# EAGLE design in2-top (EAGLE 6.4)
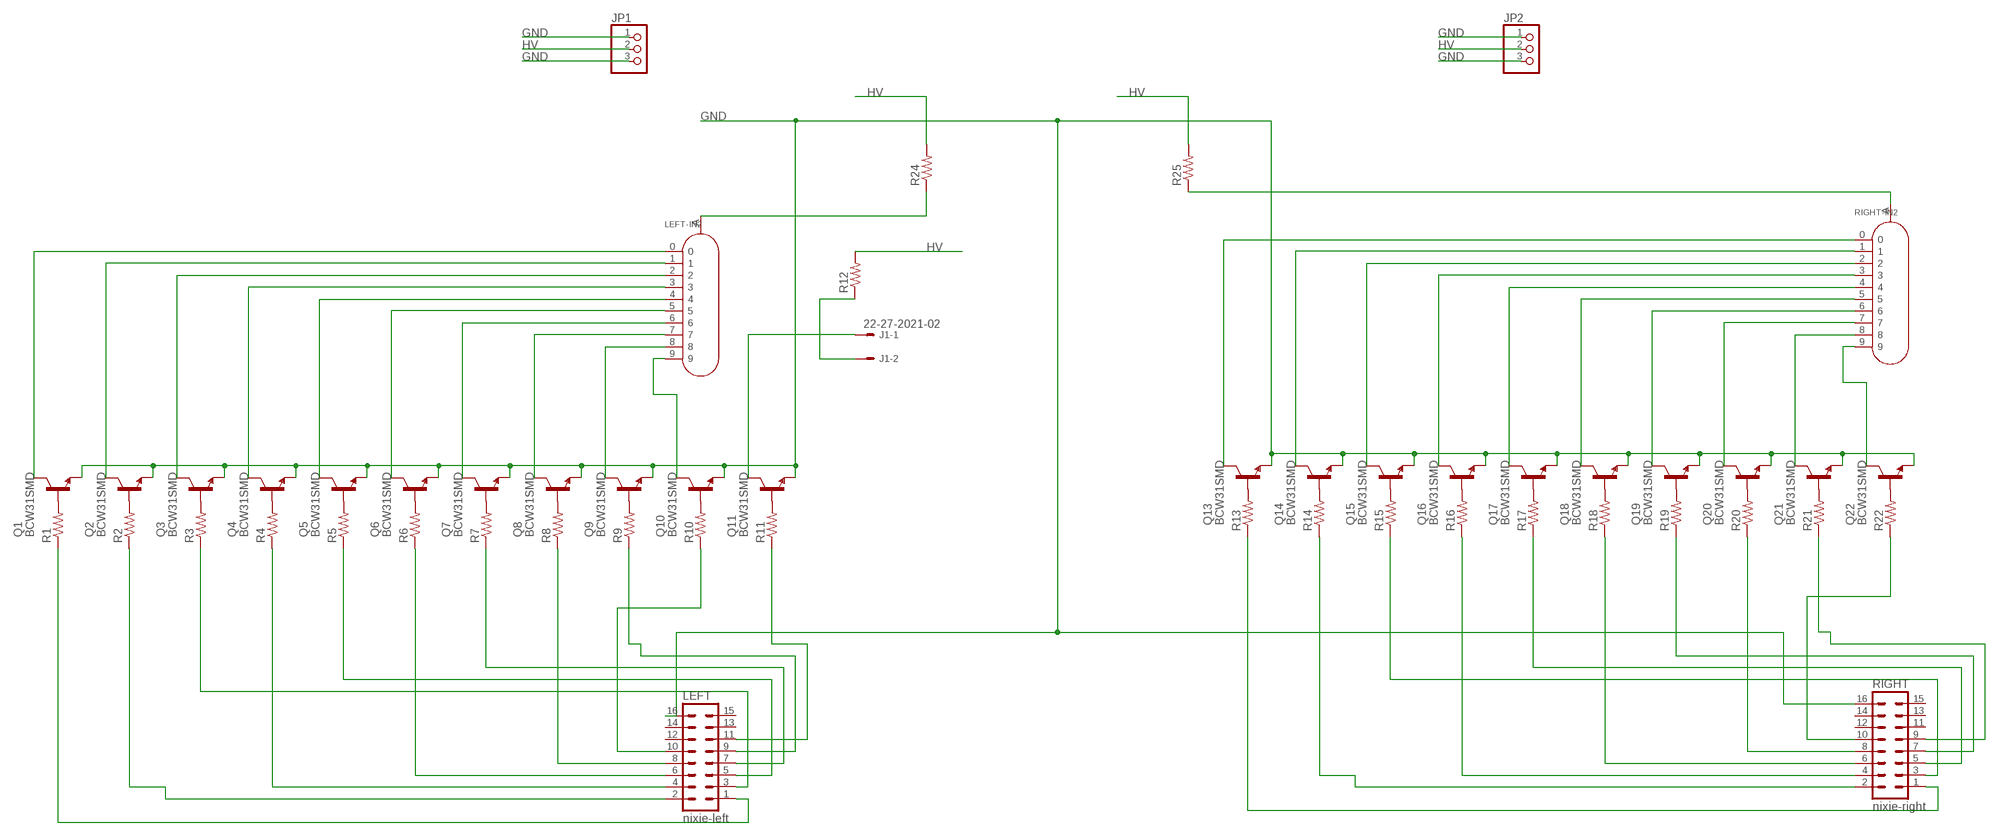
[diagram p0: schematic, sheet 1]

## Parts
J1  22-27-2021-02  [6410-02]
JP1  PINHD-1X3  [1X03]
JP2  PINHD-1X3  [1X03]
LEFT  nixie-left  ML16  [ML16]
LEFT-IN2  IN-2  [IN-2]
Q1  BCW31SMD  [SOT23-BEC]
Q2  BCW31SMD  [SOT23-BEC]
Q3  BCW31SMD  [SOT23-BEC]
Q4  BCW31SMD  [SOT23-BEC]
Q5  BCW31SMD  [SOT23-BEC]
Q6  BCW31SMD  [SOT23-BEC]
Q7  BCW31SMD  [SOT23-BEC]
Q8  BCW31SMD  [SOT23-BEC]
Q9  BCW31SMD  [SOT23-BEC]
Q10  BCW31SMD  [SOT23-BEC]
Q11  BCW31SMD  [SOT23-BEC]
Q13  BCW31SMD  [SOT23-BEC]
Q14  BCW31SMD  [SOT23-BEC]
Q15  BCW31SMD  [SOT23-BEC]
Q16  BCW31SMD  [SOT23-BEC]
Q17  BCW31SMD  [SOT23-BEC]
Q18  BCW31SMD  [SOT23-BEC]
Q19  BCW31SMD  [SOT23-BEC]
Q20  BCW31SMD  [SOT23-BEC]
Q21  BCW31SMD  [SOT23-BEC]
Q22  BCW31SMD  [SOT23-BEC]
R1  R-US_M0805  [M0805]
R2  R-US_M0805  [M0805]
R3  R-US_M0805  [M0805]
R4  R-US_M0805  [M0805]
R5  R-US_M0805  [M0805]
R6  R-US_M0805  [M0805]
R7  R-US_M0805  [M0805]
R8  R-US_M0805  [M0805]
R9  R-US_M0805  [M0805]
R10  R-US_M0805  [M0805]
R11  R-US_M0805  [M0805]
R12  R-US_R0805  [R0805]
R13  R-US_M0805  [M0805]
R14  R-US_M0805  [M0805]
R15  R-US_M0805  [M0805]
R16  R-US_M0805  [M0805]
R17  R-US_M0805  [M0805]
R18  R-US_M0805  [M0805]
R19  R-US_M0805  [M0805]
R20  R-US_M0805  [M0805]
R21  R-US_M0805  [M0805]
R22  R-US_M0805  [M0805]
R24  R-US_R0805  [R0805]
R25  R-US_R0805  [R0805]
RIGHT  nixie-right  ML16  [ML16]
RIGHT-IN2  IN-2  [IN-2]

## Nets
GND: JP1.1 JP1.3 JP2.1 JP2.3 LEFT.16 Q1.E Q2.E Q3.E Q4.E Q5.E Q6.E Q7.E Q8.E Q9.E Q10.E Q11.E Q13.E Q14.E Q15.E Q16.E Q17.E Q18.E Q19.E Q20.E Q21.E Q22.E RIGHT.16
HV: JP1.2 JP2.2 R12.2 R24.2 R25.2
N$1: LEFT-IN2.0 Q1.C
N$2: LEFT-IN2.1 Q2.C
N$3: Q1.B R1.2
N$4: Q2.B R2.2
N$5: Q3.B R3.2
N$6: Q4.B R4.2
N$7: Q5.B R5.2
N$8: Q6.B R6.2
N$9: Q7.B R7.2
N$10: Q8.B R8.2
N$11: Q9.B R9.2
N$12: Q10.B R10.2
N$13: Q11.B R11.2
N$14: LEFT-IN2.A R24.1
N$15: LEFT-IN2.2 Q3.C
N$16: LEFT-IN2.3 Q4.C
N$17: LEFT-IN2.4 Q5.C
N$18: LEFT-IN2.5 Q6.C
N$19: LEFT-IN2.6 Q7.C
N$20: LEFT-IN2.7 Q8.C
N$21: LEFT-IN2.8 Q9.C
N$22: LEFT-IN2.9 Q10.C
N$25: Q13.B R13.2
N$26: Q14.B R14.2
N$27: LEFT.1 R1.1
N$28: LEFT.2 R2.1
N$29: LEFT.3 R3.1
N$30: LEFT.4 R4.1
N$31: LEFT.5 R5.1
N$32: LEFT.6 R6.1
N$33: LEFT.7 R7.1
N$34: LEFT.8 R8.1
N$35: LEFT.9 R9.1
N$36: LEFT.10 R10.1
N$37: LEFT.11 R11.1
N$38: R25.1 RIGHT-IN2.A
N$39: Q15.B R15.2
N$40: Q16.B R16.2
N$41: Q17.B R17.2
N$42: Q18.B R18.2
N$43: Q19.B R19.2
N$44: Q20.B R20.2
N$45: Q21.B R21.2
N$46: Q22.B R22.2
N$48: R13.1 RIGHT.1
N$49: R14.1 RIGHT.2
N$50: R15.1 RIGHT.3
N$51: R16.1 RIGHT.4
N$52: R17.1 RIGHT.5
N$53: R18.1 RIGHT.6
N$54: R19.1 RIGHT.7
N$55: R20.1 RIGHT.8
N$56: R21.1 RIGHT.9
N$57: R22.1 RIGHT.10
N$59: J1.2 R12.1
N$60: Q13.C RIGHT-IN2.0
N$61: Q14.C RIGHT-IN2.1
N$62: Q15.C RIGHT-IN2.2
N$63: Q16.C RIGHT-IN2.3
N$64: Q17.C RIGHT-IN2.4
N$65: Q18.C RIGHT-IN2.5
N$66: Q19.C RIGHT-IN2.6
N$67: Q20.C RIGHT-IN2.7
N$68: Q21.C RIGHT-IN2.8
N$69: Q22.C RIGHT-IN2.9
N$72: J1.1 Q11.C
Unconnected: LEFT.12 LEFT.13 LEFT.14 LEFT.15 RIGHT.11 RIGHT.12 RIGHT.13 RIGHT.14 RIGHT.15

## Library data of the parts
J1 = con-molex:22-?-02: CONNECTOR wire to board 2.54 mm (.1 inch) pitch header; OC_FARNELL: unknown; OC_NEWARK: unknown
JP1 JP2 = pinhead:PINHD-1X3: PIN HEADER
LEFT RIGHT = con-ml:ML16: HARTING; OC_FARNELL: unknown; OC_NEWARK: unknown
LEFT-IN2 RIGHT-IN2 = 0-nixies-russian:IN-2: IN-2 Miniature Nixie Tube 19mm Dia, Top View Strike voltage: <200V Standby voltage: <100V Current: 1.5mA
Q1-Q11 Q13-Q22 = transistor-npn:BCW31*: NPN Transistor
R1-R22 R24 R25 = resistor:R-US_: RESISTOR, American symbol

## Board
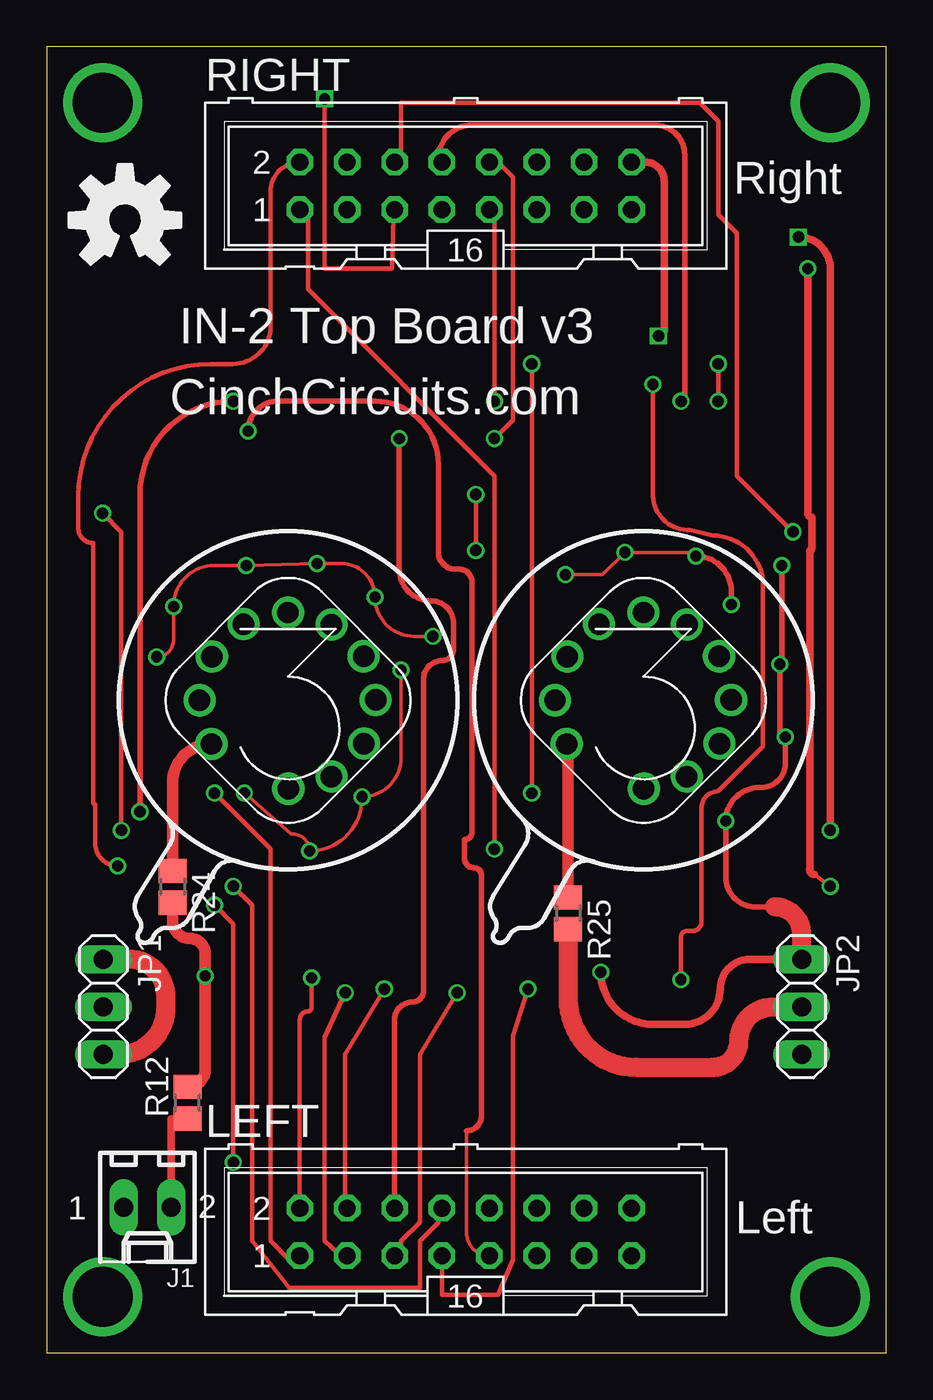
[diagram p1: board, top side]
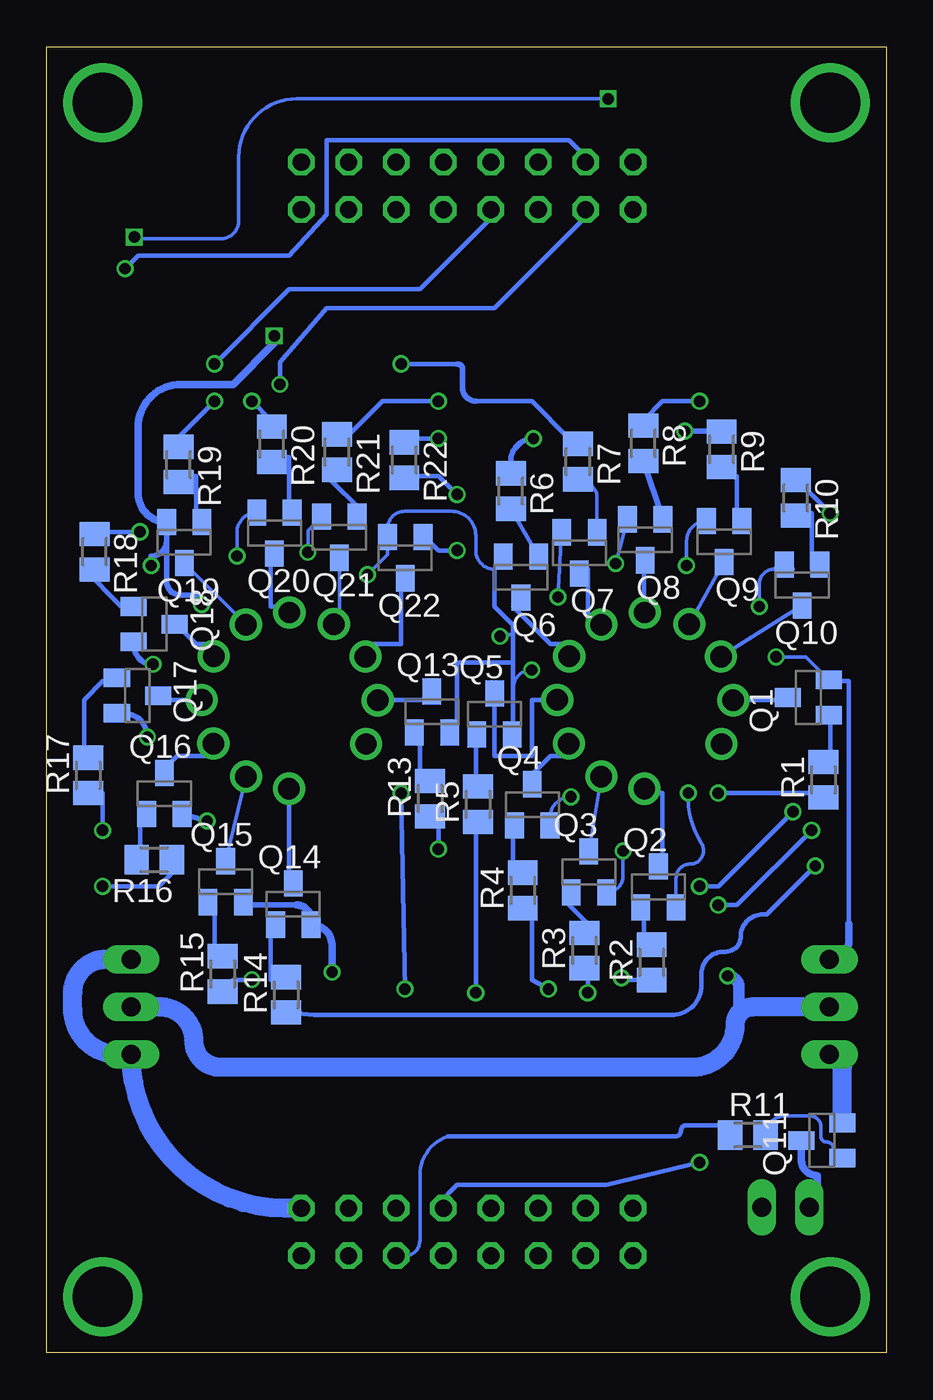
[diagram p2: board, bottom side, seen from below]

Size 45 x 70 mm. Coordinates in mm from the lower left corner, seen from the top.
Outline: 0,0 45,0 45,70 0,70 0,0
Copper layers (1*16): Top 0.035mm / dielectric 1.5mm / Bottom 0.035mm
Design rules "Fusion_eagle_rule_v1.1": minimum track width 6mil, minimum drill 12mil, track to track 6mil, track to pad 6mil, pad to pad 6mil, via to via 6mil, smd to smd 0mil, copper to edge 10mil, drill to drill 10mil, minimum pad ring 10mil, minimum via ring 6mil, stop-mask expansion 2mil, vias tented up to drill 100mil, thermal gap 10mil

### Footprints (pad centres in the part's own frame; a part is rotated, then mirrored left to right if it is on the bottom)
6410-02 = drill 1.016 long: 1 1.27,0; 2 -1.27,0
1X03 = drill 1.016 long: 1 -2.54,0; 2 0,0; 3 2.54,0
ML16 = drill 0.914 octagon: 1 -8.89,-1.27; 2 -8.89,1.27; 3 -6.35,-1.27; 4 -6.35,1.27; 5 -3.81,-1.27; 6 -3.81,1.27; 7 -1.27,-1.27; 8 -1.27,1.27; 9 1.27,-1.27; 10 1.27,1.27; 11 3.81,-1.27; 12 3.81,1.27; 13 6.35,-1.27; 14 6.35,1.27; 15 8.89,-1.27; 16 8.89,1.27
IN-2 = drill 1.15: 0 -4.745,0; 1 0.02,-4.735; 2 2.326,-4.089; 3 4.07,-2.32; 4 4.695,0.02; 5 4.052,2.363; 6 2.33,4.057; 7 0,4.705; 8 -2.388,4.081; 9 -4.082,2.343; A -4.11,-2.34
SOT23-BEC = smd 1 x 1.4: B -0.95,-1.1; C 0,1.1; E 0.95,-1.1
M0805 = smd 1.3 x 1.6: 1 -0.95,0; 2 0.95,0
R0805 = smd 1.3 x 1.5: 1 -0.85,0; 2 0.85,0

### Placement (x,y rotation side)
J1  5.4,7.8 180 top
JP1  3.04,18.54 270 top
JP2  40.47,18.54 270 top
LEFT  22.46,6.48 0 top
LEFT-IN2  12.94,34.97 0 top
Q1  4.17,35.12 90 bottom
Q2  12.21,24.97 0 bottom
Q3  15.94,25.77 0 bottom
Q4  18.97,29.37 0 bottom
Q5  20.99,34.23 0 bottom
Q6  19.58,41.57 180 bottom
Q7  16.45,42.87 180 bottom
Q8  12.92,43.57 180 bottom
Q9  8.69,43.47 180 bottom
Q10  4.51,41.15 180 bottom
Q11  3.45,11.38 90 bottom
Q13  24.35,34.35 0 bottom
Q14  31.78,24.05 0 bottom
Q15  35.41,25.25 0 bottom
Q16  38.69,29.97 0 bottom
Q17  40.13,35.22 270 bottom
Q18  39.23,39.05 270 bottom
Q19  37.62,43.43 180 bottom
Q20  32.79,43.93 180 bottom
Q21  29.31,43.71 180 bottom
Q22  25.78,42.61 180 bottom
R1  3.37,30.71 90 bottom
R2  12.57,20.93 90 bottom
R3  16.18,21.56 90 bottom
R4  19.48,24.78 90 bottom
R5  21.88,29.4 90 bottom
R6  20.12,46.18 270 bottom
R7  16.52,47.76 270 bottom
R8  13.02,48.74 270 bottom
R9  8.82,48.42 270 bottom
R10  4.85,45.82 270 bottom
R11  7.41,11.67 0 bottom
R12  7.55,13.4 90 top
R13  24.45,29.7 90 bottom
R14  32.17,19.19 90 bottom
R15  35.57,20.31 90 bottom
R16  39.23,26.43 180 bottom
R17  42.77,30.95 90 bottom
R18  42.43,42.93 270 bottom
R19  37.93,47.61 270 bottom
R20  32.93,48.69 270 bottom
R21  29.43,48.27 270 bottom
R22  25.83,47.85 270 bottom
R24  6.75,24.98 270 top
R25  27.95,23.56 270 top
RIGHT  22.46,62.54 0 top
RIGHT-IN2  31.99,34.97 0 top

### Tracks (layer width: path | path; a pad name or v marks a point on that pad's centre or on a via)
GND  (via drill 0.6)
  Top 0.2: v5.9,37.3 arc90 6.8,38.2 v6.8,40 arc-90 9,42.2 v10.7,42.2 v14.5,42.3 15.8,42.3 arc-90 v17.6,40.5 arc90 19.7,38.4 v20.7,38.4 | v10.6,30 13.1,27.8 13.2,27.8 arc-90 v14.1,26.9 arc90 16.9,29.7 v16.9,29.8 arc90 19,31.9 v19,36.6 | v27.8,41.7 29.8,41.7 v31,42.9 34.6,42.9 arc-90 v34.8,42.7
  Top 0.305: 39.02,23.9 38,23.9 arc-90 36.4,25.5 v36.4,28.5 arc-90 38.2,30.3 38.3,30.3 arc90 39.6,31.6 v39.6,33 arc-90 39.3,33.3 v39.3,36.9 arc90 39.4,37 v39.4,42.2 | v36.7,40.1 36.7,40.8 arc90 v34.8,42.7
  Top 0.406: RIGHT.16 32.09,63.81 arc-90 33.1,62.8 33.1,54.8 arc-90 v32.8,54.5 | v29.7,20.4 arc90 32.5,17.6 34.2,17.6 arc90 36.1,19.5 arc-90 37.68,21.08 JP2.1
  Top 1.016: JP2.1 40.47,22.45 arc90 39.02,23.9 | JP1.3 3.9,16 arc90 6.4,18.5 6.4,19.1 arc90 4.4,21.1 3.06,21.1 arc90 JP1.1
  Bottom 0.2: Q1.E 4.3,37.3 v5.9,37.3 | v6.8,40 6.8,41.2 arc90 6,42 | Q9.E arc-90 10.7,43.51 v10.7,42.2 | Q8.E v14.5,42.3 | Q7.E v17.6,40.5 | v20.7,38.4 arc90 20.6,38.5 20,38.5 | Q2.E 11.26,25.44 arc90 10.5,26.2 arc-123 9.9,27.3 arc36 v10.6,30 | v14.1,26.9 14.1,25.56 arc90 Q3.E | Q4.E 18.02,28.68 arc90 v16.9,29.8 | 20,33 20,35.6 arc90 v19,36.6 | 21,42 arc90 22,43 22,43.8 arc-90 23.3,45.1 25.8,45.1 arc-90 26.73,44.17 Q22.E 26.73,42.77 v27.8,41.7 | v31,42.9 31,44.07 Q21.E | Q20.E arc-90 34.8,43.97 v34.8,42.7
  Bottom 0.254: 6,42 5,42 Q10.E | 10,44 Q9.E | 2,23 2,36 3,36 Q1.E | 20,37 20,38.5 20,39 21,40 21,42 Q6.E | 20,37 20,33 Q5.E | 20,37 23,37 23,33 Q13.E
  Bottom 0.305: Q16.E v36.4,28.5 | Q17.E 40.87,34.27 arc90 v39.6,33 | Q18.E 40.33,37.93 arc-90 v39.3,36.9 | v39.4,42.2 39.4,42.7 arc-90 38.57,43.53 Q19.E 38.57,41.37 arc-90 37.8,40.6 37.2,40.6 arc90 v36.7,40.1 | 34.46,24 31.6,24
  Bottom 0.406: v32.8,54.5 32.8,54.1 35,51.9 37.8,51.9 arc-90 40.1,49.6 40.1,46.06 arc-90 Q19.E | v29.7,20.4 29.7,21.82 arc-90 Q14.E 30.83,23.23 arc-90 31.6,24 | Q15.E 34.46,24 | 2,23 2,22.12 arc90 JP1.1
  Bottom 1.016: LEFT.16 32.22,7.75 arc90 JP2.3 41.2,16 arc90 43.6,18.4 43.6,19.3 arc90 41.8,21.1 40.49,21.1 arc90 JP2.1 | Q11.E 2.35,15.31 arc-90 JP1.3
HV  (via drill 0.6)
  Top 0.61: R24.2 6.75,23.15 arc90 7.7,22.2 arc-90 8.5,21.4 v8.5,20.2 8.5,15.2 arc-90 R12.2
  Top 1.016: R25.2 27.95,18.95 arc90 31.6,15.3 35.7,15.3 arc90 37.1,16.7 arc-90 38.94,18.54 JP2.2
  Bottom 0.61: v8.5,20.2 arc90 7.9,19.6 7.9,18.4 arc90 7.76,18.54 7.16,18.54
  Bottom 1.016: JP1.2 7.16,18.54 arc-90 8.1,17.6 arc90 10.4,15.3 35.7,15.3 arc90 37.1,16.7 arc-90 38.94,18.54 JP2.2
N$1
  Bottom 0.254: Q1.C 5,35 8,35 LEFT-IN2.0
N$2
  Bottom 0.254: Q2.C 12,26 12,30 13,30 LEFT-IN2.1
N$3
  Bottom 0.254: Q1.B 3,34 3,32 R1.2
N$4
  Bottom 0.254: Q2.B 13,24 13,22 R2.2
N$5
  Bottom 0.254: Q3.B 17,24 16,23 R3.2
N$6
  Bottom 0.254: Q4.B 20,28 20,26 R4.2
N$7
  Bottom 0.254: Q5.B 22,33 22,30 R5.2
N$8
  Bottom 0.2: Q6.B R6.2
N$9
  Bottom 0.2: R7.2 arc90 15.5,45.79 Q7.B
N$10
  Bottom 0.305: R8.2 Q8.B
N$11
  Bottom 0.254: Q9.B 8,45 8,47 9,47 R9.2
N$12
  Bottom 0.254: Q10.B 4,42 4,45 5,45 R10.2
N$13
  Bottom 0.2: R11.2 arc90 5.43,12.7 4.1,12.7 arc90 3.5,12.1 3.5,11.6 arc-90 3.2,11.3 arc127 2.9,10.7 arc-201 Q11.B
N$14
  Top 0.61: R24.1 6.75,30.55 arc-90 LEFT-IN2.A
N$15
  Bottom 0.2: Q3.C LEFT-IN2.2
N$16
  Bottom 0.254: Q4.C 19,31 18,32 17,32 LEFT-IN2.3
N$17
  Bottom 0.254: Q5.C 21,35 21,32 19,32 19,35 18,35 LEFT-IN2.4
N$18
  Bottom 0.254: Q6.C 20,40 18,38 17,38 LEFT-IN2.5
N$19
  Bottom 0.254: Q7.C 16,42 16,39 LEFT-IN2.6
N$20
  Bottom 0.254: Q8.C 13,42 13,40 LEFT-IN2.7
N$21
  Bottom 0.2: Q9.C LEFT-IN2.8
N$22
  Bottom 0.2: Q10.C LEFT-IN2.9
N$25
  Bottom 0.254: Q13.B 25,33 25,31 R13.2
N$26
  Bottom 0.254: Q14.B 33,23 33,20 32,20 R14.2
N$27  (via drill 0.61)
  Top 0.254: v9,30 12,27 12,6 13,5 LEFT.1
  Bottom 0.254: v9,30 4,30 R1.1
N$28  (via drill 0.6)
  Top 0.254: LEFT.2 13.57,17.87 arc-90 14,18.3 arc90 14.2,18.5 v14.2,20.1
  Bottom 0.254: v14.2,20.1 arc-90 14.08,19.98 R2.1
N$29  (via drill 0.61)
  Top 0.254: v16,19.3 14.9,16.9 14.9,6 16,5 LEFT.3
  Bottom 0.254: v16,19.3 16,20 R3.1
N$30  (via drill 0.61)
  Top 0.254: v18.1,19.5 16,16 16,8 LEFT.4
  Bottom 0.254: v18.1,19.5 19,20 19,24 R4.1
N$31  (via drill 0.61)
  Top 0.254: v22,19.3 20,16 20,7 19,6 19,5 LEFT.5
  Bottom 0.254: v22,19.3 22,28 R5.1
N$32  (via drill 0.6)
  Top 0.305: LEFT.6 18.65,17.85 arc-90 19.6,18.8 arc90 20.2,19.4 20.2,36.1 arc-90 21.2,37.1 arc90 21.8,37.7 21.8,39.1 arc90 20.6,40.3 arc-90 18.9,42 v18.9,49
  Bottom 0.305: v18.9,49 arc-90 20.12,47.78 R6.1
N$33  (via drill 0.61)
  Top 0.254: v26,30 v26,53 | v25.8,19.5 25,17 25,5 24.2,3.1 21.2,3.1 21.2,5.1 LEFT.7
  Bottom 0.254: 22,51 19,51 17,49 R7.1 | v26,53 23,53 | v25.8,19.5 v26,30
  Bottom 0.305: 22,51 arc90 22.7,51.7 22.7,52.7 arc-90 23,53
N$34  (via drill 0.61)
  Top 0.254: v10,25 11,24 11,6 13,3.5 20,3.5 20,6 21,7 21,8 LEFT.8
  Top 0.305: v5,29 5,46 arc-90 v10,51
  Bottom 0.254: v10,51 12,51 13,50 R8.1 | v5,29 9,25 v10,25
N$35  (via drill 0.6)
  Top 0.2: LEFT.9 arc-90 22.5,6.44 22.5,11.9
  Top 0.305: 22.5,11.9 arc90 23.3,12.7 23.3,25.6 arc90 22.9,26 arc-90 22.4,26.5 22.4,27.5 arc90 22.8,27.9 22.8,41.3 arc90 22.1,42 21.9,42 arc-90 21,42.9 21,47.6 arc90 17.6,51 12.4,51 arc90 v10.8,49.4
  Bottom 0.305: v10.8,49.4 8.85,49.4 arc90 R9.1
N$36  (via drill 0.61)
  Top 0.254: v3,45 4,44 v4,28 | v9,24 10,23 v10,10.2
  Bottom 0.254: v3,45 5,47 R10.1 | v4,28 8,24 v9,24 | v10,10.2 15,9 23,9 24,8 LEFT.10
N$37
  Bottom 0.2: LEFT.11 25.79,5.21 arc-90 25,6 25,9.5 arc71 23.5,11.6
  Bottom 0.254: 23.5,11.6 11.3,11.6 arc-90 11,11.9 arc90 10.7,12.2 8.7,12.2 arc90 8.36,11.86 R11.1
N$38
  Top 0.61: RIGHT-IN2.A arc-90 27.95,32.56 R25.1
N$39
  Bottom 0.254: Q15.B 36,24 36,21 R15.2
N$40
  Bottom 0.254: Q16.B 40,29 40,27 R16.2
N$41
  Bottom 0.254: Q17.B 41,36 42,36 43,35 43,32 R17.2
N$42
  Bottom 0.254: Q18.B 41,40 43,42 R18.2
N$43
  Bottom 0.254: Q19.B 37,45 37,47 38,47 R19.2
N$44
  Bottom 0.254: Q20.B 32,45 32,48 33,48 R20.2
N$45
  Bottom 0.254: Q21.B 28,45 30,47 R21.2
N$46  (via drill 0.61)
  Top 0.254: v23,46 v23,43
  Bottom 0.254: v23,43 24,43 25,44 Q22.B | v23,46 24,47 26,47 R22.2
N$47  (via drill 3.2)
  other vias: 42,67
N$48  (via drill 0.61)
  Top 0.254: v24,27 24,47 14,57 14,61 RIGHT.1
  Bottom 0.254: v24,27 24,29 R13.1
N$49  (via drill 0.6)
  Top 0.254: v3.8,26.1 arc-90 2.6,27.3 2.6,29.4 arc-90 2.5,29.5 2.5,43.4 arc-90 1.7,44.2 1.7,45.9 arc-90 8.8,53 10,53 arc90 12,55 12,62.24 arc-90 RIGHT.2
  Bottom 0.254: v3.8,26.1 6.4,23.5 6.6,23.5 arc-90 7.8,22.3 arc90 8.6,21.5 8.7,21.5 arc-90 9.9,20.3 9.9,19.7 arc90 11.5,18.1 30.7,18.1 R14.1
N$50  (via drill 0.6)
  Top 0.254: v34,20 34,22.3 arc-90 34.3,22.6 34.6,22.6 arc90 35.1,23.1 35.1,29.2 arc-90 36,30.1 38.4,32.5 38.4,41.1 arc90 35.7,43.8 34.5,44.1 arc-90 32.5,45.9 v32.5,51.9
  Bottom 0.254: v34,20 35,20 R15.1 | RIGHT.3 16,61 21,56 30,56 32.5,53.1 v32.5,51.9
N$51  (via drill 0.61)
  Top 0.2: 40.8,25.9 40.9,26
  Top 0.254: 40.8,25.9 41.15,25.64 v42,25
  Top 0.406: v40.8,58.1 40.8,45 arc90 41,44.8 41,43.1 arc-90 40.9,43 40.9,25.89 arc90 41.15,25.64
  Bottom 0.254: v42,25 39,25 38,26 R16.1 | v40.8,58.1 40.1,58.8 32,58.8 30,61 30,65 17,65 16,64 RIGHT.4
N$52  (via drill 0.6, 0.61)
  Top 0.254: v14.9,67.2 14.9,58.1 18.5,58.1 18.6,60.9 RIGHT.5
  Top 0.406: v42,28 42,58.1 arc90 v40.3,59.8
  Bottom 0.2: v14.9,67.2 31.6,67.2 arc-90 34.7,64.1 34.7,60.7 arc90 35.7,59.7 40.2,59.7 arc90 v40.3,59.8
  Bottom 0.254: v42,28 42,30 R17.1
N$53  (via drill 0.61)
  Top 0.254: v40,44 37,47 37,60 36,61 36,66 35,67 19,67 19,64 RIGHT.6
  Bottom 0.254: v40,44 42,44 R18.1
N$54  (via drill 0.61)
  Top 0.254: v36,53 v36,51
  Bottom 0.254: v36,51 38,49 R19.1 | v36,53 32,57 25,57 21,61 RIGHT.7
N$55  (via drill 0.61)
  Top 0.254: 34.2,51.6 v34,51 | 21,64 RIGHT.8
  Top 0.305: 21,64 arc-90 22.8,65.8 32.6,65.8 arc-90 34.2,64.2 34.2,51.2 arc-90 v34,51
  Bottom 0.254: v34,51 33,50 R20.1
N$56  (via drill 0.61)
  Top 0.254: v24,51 24,61 RIGHT.9
  Bottom 0.254: v24,51 27,51 29,49 R21.1
N$57  (via drill 0.61)
  Top 0.254: v24,49 25,50 25,63 24,64 RIGHT.10
  Bottom 0.254: v24,49 26,49 R22.1
N$59
  Top 0.406: R12.1 6.67,12.55 J1.2
N$60
  Bottom 0.254: Q13.C 24,35 27,35 RIGHT-IN2.0
N$61
  Bottom 0.254: Q14.C 32,25 32,30 RIGHT-IN2.1
N$62
  Bottom 0.2: Q15.C RIGHT-IN2.2
N$63
  Bottom 0.254: Q16.C 39,31 38,32 36,32 RIGHT-IN2.3
N$64
  Bottom 0.254: Q17.C 39,35 37,35 RIGHT-IN2.4
N$65
  Bottom 0.254: Q18.C 38,39 37,38 36,38 RIGHT-IN2.5
N$66
  Bottom 0.2: Q19.C RIGHT-IN2.6
N$67
  Bottom 0.254: Q20.C 33,43 33,40 32,40 RIGHT-IN2.7
N$68
  Bottom 0.2: Q21.C 29.31,39.34 arc90 RIGHT-IN2.8
N$69
  Bottom 0.254: Q22.C 26,41 26,38 28,38 RIGHT-IN2.9
N$70
  Top 0.2: 4.99,58.79 arc9 5.29,58.95 6.05,58.34 6.56,58.85 5.95,59.61 arc19 6.21,60.24 7.18,60.33 7.18,61.07 6.21,61.16 arc19 5.95,61.79 6.56,62.55 6.05,63.06 5.29,62.45 arc19 4.66,62.71 4.57,63.68 3.83,63.68 3.74,62.71 arc19 3.11,62.45 2.35,63.06 1.84,62.55 2.45,61.79 arc19 2.19,61.16 1.22,61.07 1.22,60.33 2.19,60.24 arc19 2.45,59.61 1.84,58.85 2.35,58.34 3.11,58.95 arc9 3.41,58.79 3.84,59.83 arc-68 3.26,60.7 arc-248 4.56,59.83 4.99,58.79
N$72
  Bottom 0.406: Q11.C 4.55,10.35 arc-90 3.7,9.5 3.7,8.1 4.13,8.1 J1.1
N$77  (via drill 3.2)
  other vias: 3,67
N$78  (via drill 3.2)
  other vias: 3,3
N$79  (via drill 3.2)
  other vias: 42,3

### Text on the board
tPlace: Right | IN-2 Top Board v3 | CinchCircuits.com | Left